# Altium schematic sheet Chocolate_Vending_Machine_V1.0.SchDoc
size A4; SheetNumber: 1; SheetTotal: 1
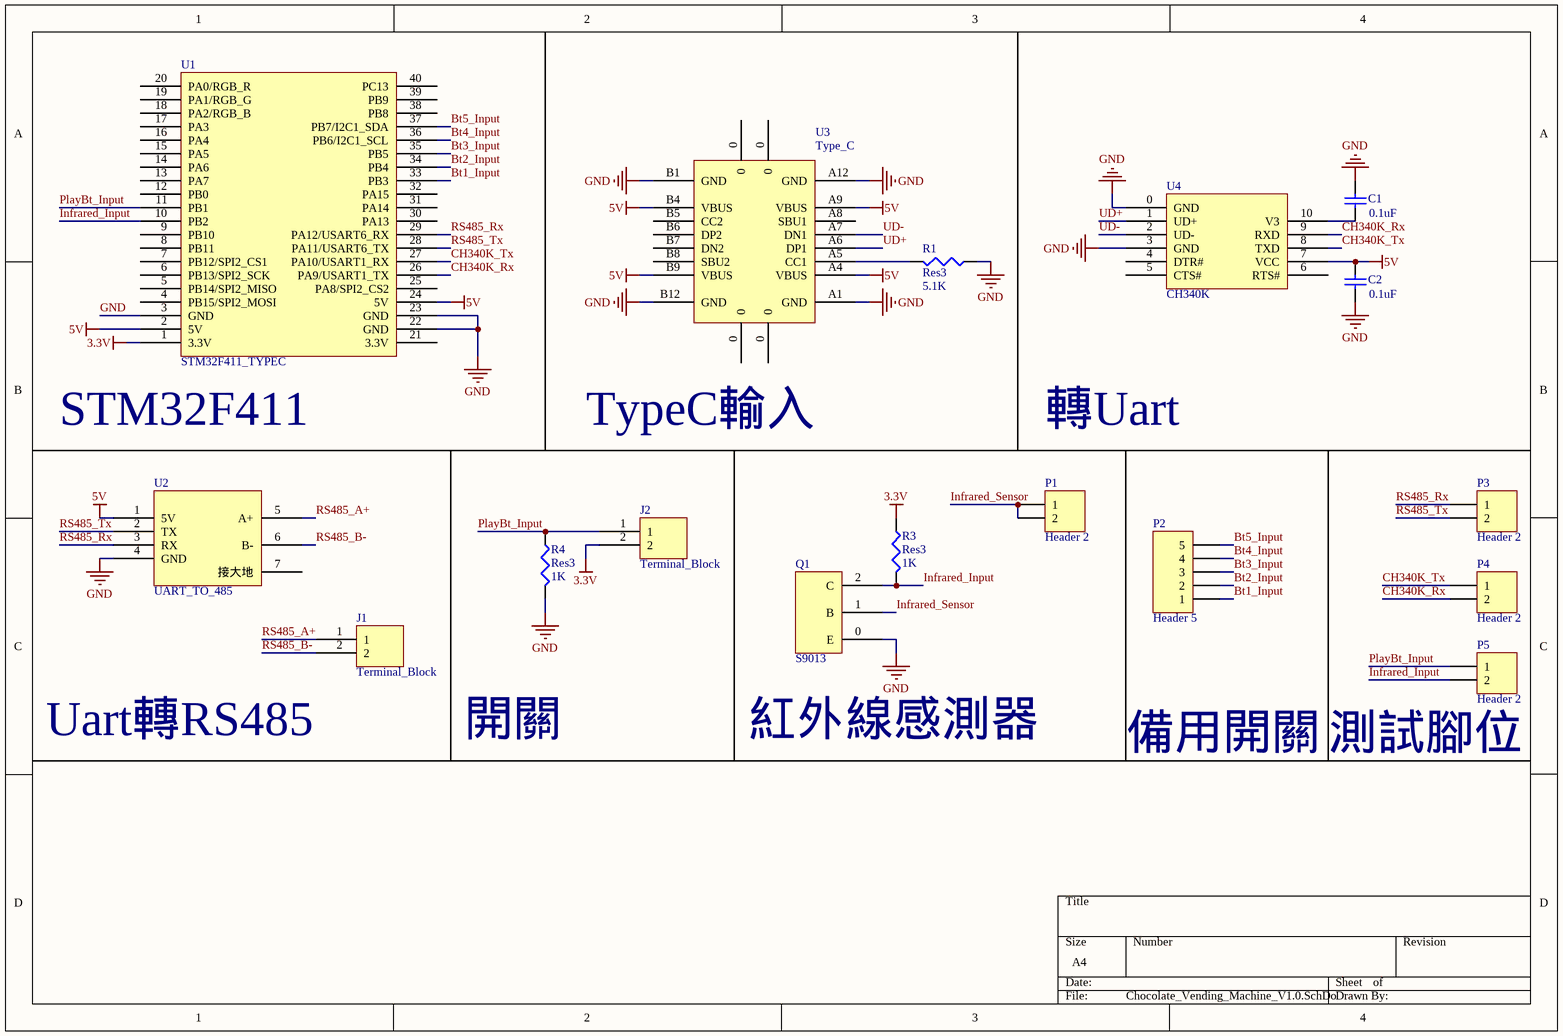
[diagram p0: Chocolate_Vending_Machine_V1.0.SchDoc]

## Parts
C1  value 0.1uF  [1608[0603]]  (hidden comment: Cap Semi)
C2  value 0.1uF  [1608[0603]]  (hidden comment: Cap Semi)
J1  Terminal_Block  [terminal block]
J2  Terminal_Block  [terminal block]
P1  Header 2  [HDR1X2]
P2  Header 5  [HDR1X5]
P3  Header 2  [HDR1X2]
P4  Header 2  [HDR1X2]
P5  Header 2  [HDR1X2]
Q1  S9013  [S9013]
R1  Res3  value 5.1K  [J1-0603]
R3  Res3  value 1K  [J1-0603]
R4  Res3  value 1K  [J1-0603]
U1  STM32F411_TYPEC  [STM32F411_TypeC]
U2  UART_TO_485  [UART_TO_RS485]
U3  Type_C  [Type_C_V2]
U4  CH340K  [CH340K_V1]

## Nets
3.3V: J2.2 R3.1 U1.1(3.3V)
5V: C2.2 U1.2(5V) U1.24(5V) U2.1(5V) U3.A4(VBUS) U3.A9(VBUS) U3.B4(VBUS) U3.B9(VBUS) U4.7(VCC)
GND: C1.2 C2.1 Q1.0(E) R1.1 R4.2 U1.3(GND) U1.22(GND) U1.23(GND) U2.4(GND) U3.A1(GND) U3.A12(GND) U3.B1(GND) U3.B12(GND) U4.0(GND) U4.3(GND)
Bt1_Input: P2.1 U1.33(PB3)
Bt2_Input: P2.2 U1.34(PB4)
Bt3_Input: P2.3 U1.35(PB5)
Bt4_Input: P2.4 U1.36(PB6/I2C1_SCL)
Bt5_Input: P2.5 U1.37(PB7/I2C1_SDA)
CH340K_Rx: P4.2 U1.26(PA9/USART1_TX) U4.9(RXD)
CH340K_Tx: P4.1 U1.27(PA10/USART1_RX) U4.8(TXD)
Infrared_Input: P5.2 Q1.2(C) R3.2 U1.10(PB2)
Infrared_Sensor: P1.1 P1.2 Q1.1(B)
PlayBt_Input: J2.1 P5.1 R4.1 U1.11(PB1)
RS485_A+: J1.1 U2.5(A+)
RS485_B-: J1.2 U2.6(B-)
RS485_Rx: P3.1 U1.29(PA12/USART6_RX) U2.3(RX)
RS485_Tx: P3.2 U1.28(PA11/USART6_TX) U2.2(TX)
UD+: U3.A6(DP1) U4.1(UD+)
UD-: U3.A7(DN1) U4.2(UD-)
NetC1_1: C1.1 U4.10(V3)
NetR1_2: R1.2 U3.A5(CC1)

Not connected (* = marked no-connect by the designer): U1 4(PB15/SPI2_MOSI) 5(PB14/SPI2_MISO) 6(PB13/SPI2_SCK) 7(PB12/SPI2_CS1) 8(PB11) 9(PB10) 12(PB0) 13(PA7) 14(PA6) 15(PA5) 16(PA4) 17(PA3) 18(PA2/RGB_B) 19(PA1/RGB_G) 20(PA0/RGB_R) 21(3.3V) 25(PA8/SPI2_CS2) 30(PA13) 31(PA14) 32(PA15) 38(PB8) 39(PB9) 40(PC13); U2 7(接大地); U3 0 A8(SBU1) B5(CC2) B6(DP2) B7(DN2) B8(SBU2); U4 4(DTR#) 5(CTS#) 6(RTS#)

## Notes on the sheet
- (near U1) STM32F411
- TypeC輸入
- 轉Uart
- Uart轉RS485
- 開關
- 紅外線感測器
- 備用開關
- 測試腳位

## Library data of the parts
C1 C2 = Cap Semi: Capacitor (Semiconductor SIM Model); Published: 8-Jun-2000; LatestRevisionDate: 29-May-2009; LatestRevisionNote: IPC-7351 Footprint Added.; PackageReference: C1206; Publisher: Altium Limited; PackageDescription: Chip Capacitor
J1 J2 = Terminal Block
P1 P3-P5 = Header 2: Header, 2-Pin; LatestRevisionDate: 17-Jul-2002; LatestRevisionNote: Re-released for DXP Platform.; Publisher: Altium Limited
P2 = Header 5: Header, 5-Pin; LatestRevisionDate: 17-Jul-2002; LatestRevisionNote: Re-released for DXP Platform.; Publisher: Altium Limited
R1 R3 R4 = Res3: Resistor; Published: 8-Jun-2000; LatestRevisionDate: 29-May-2009; LatestRevisionNote: IPC-7351 Footprint Added.; PackageReference: J1-0603; Publisher: Altium Limited; PackageDescription: Chip Resistor